# EasyEDA Pro project ProProject_CN3791_2024-04-01.epro

# Schematic Schematic1
Create Date: 2023-11-17; Page Name: P1; Project Name: CN3791; Schematic Name: Schematic1; Update Date: 2023-11-26; Company: EasyEDA.com; Drawed: EasyEDA Pro; Page Size: A4; Part Number: JLCPCB-002; Reviewed: EasyEDA Pro; Version: V0.1
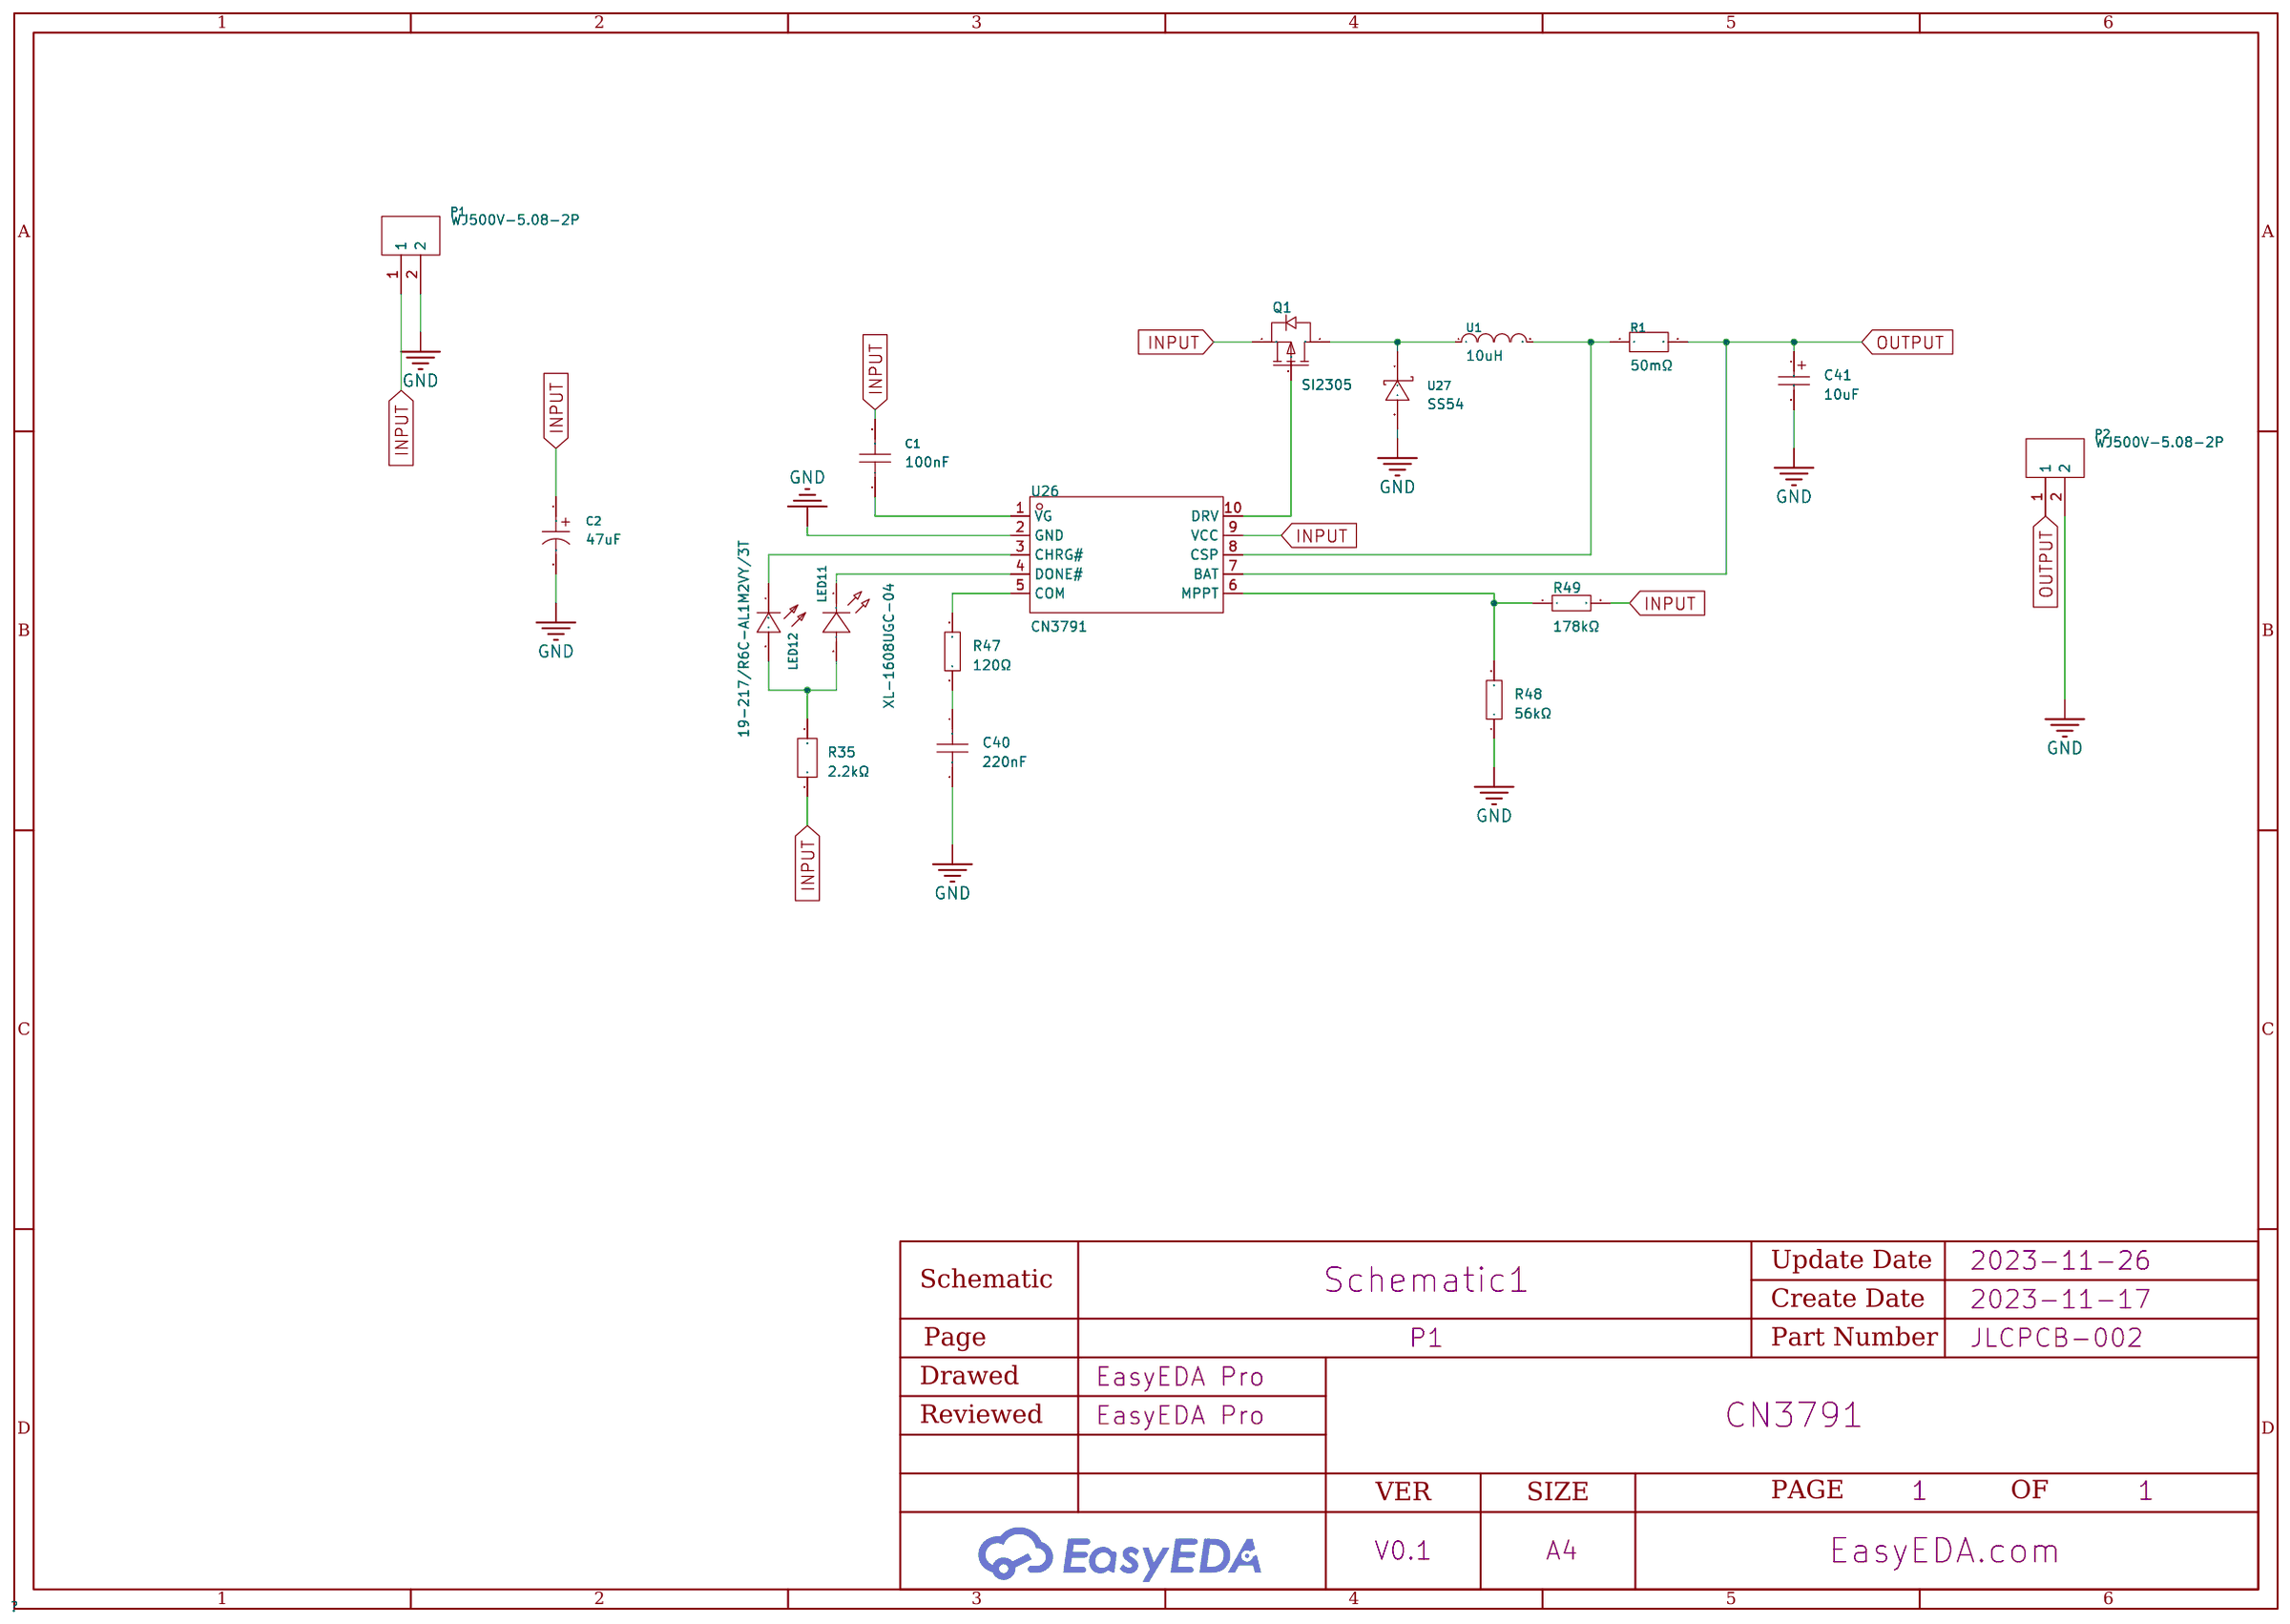
[diagram p0: schematic sheet]

## Parts
C1  100nF  [C0402]
C2  47uF  [CAP-SMD_BD6.3-L6.6-W6.6-LS7.6-FD]
C40  220nF  [C0402]
C41  10uF  [CAP-SMD_L3.2-W1.6-RD]
LED11  XL-1608UGC-04  [LED0603-RD_GREEN]
LED12  19-217/R6C-AL1M2VY/3T  [LED0603-RD]
P1  WJ500V-5.08-2P  [CONN-TH_2P-P5.00_WJ500V-5.08-2P]
P2  WJ500V-5.08-2P  [CONN-TH_2P-P5.00_WJ500V-5.08-2P]
Q1  SI2305  [SOT-23-3_L2.9-W1.3-P1.90-LS2.4-BR]
R1  50mΩ  [R1206]
R35  2.2kΩ  [R2010]
R47  120Ω  [R0402]
R48  56kΩ  [R0402]
R49  178kΩ  [R0402]
U1  10uH  [IND-SMD_L7.2-W6.6_GPSR07X0]
U26  CN3791  [SSOP-10_L4.9-W3.9-P1.00-LS6.0-BL]
U27  SS54  [SMC_L6.9-W5.9-LS7.9-RD]

## Library data of the parts
C1 = CT41G-0402-2X1-16V-0.1μF-K(N): Capacitance: Tolerance:±10% Tolerance:±10% Voltage Rated: Temperature Coefficient:; LCSC Part Name: 100nF ±10% 16V; Supplier Part: C141382; Manufacturer: TORCH(火炬); Supplier Footprint: 0402; JLCPCB Part Class: Extended Part; Datasheet: https://atta.szlcsc.com/upload/public/pdf/source/20171225/C150708_15141883600121203188.pdf; Supplier: LCSC; Tolerance: ±10%
C2 = RVT47UF50V67RV0029: Capacitance: Tolerance:±20% Tolerance:±20% Rated Voltage: Ripple Current:66mA@120Hz Equivalent Series Resistance(ESR):- φD: L: Lifetime @ Temp:2000hrs@105℃ Operating Temperature:-55℃~+105℃ Operating Temperature:-55℃~+105℃; LCSC Part Name: 47uF ±20% 50V; Supplier Part: C2887275; Manufacturer: KNSCHA(科尼盛); Supplier Footprint: SMD,D6.3xL7.7mm; JLCPCB Part Class: Extended Part; Datasheet: https://atta.szlcsc.com/upload/public/pdf/source/20210824/3B61B08E802BEB202F31F6CC5BD6B8B5.pdf; Supplier: LCSC; Tolerance: ±20%; Ripple Current: 66mA@120Hz; Lifetime @ Temp: 2000hrs@105℃; Operating Temperature: -55℃~+105℃
C40 = 0402B224K160NT: Capacitance: Tolerance:±10% Tolerance:±10% Voltage Rated: Temperature Coefficient:; LCSC Part Name: 220nF ±10% 16V; Supplier Part: C192432; Manufacturer: FH(风华); Supplier Footprint: 0402; JLCPCB Part Class: Extended Part; Supplier: LCSC; Tolerance: ±10%
C41 = CA45-A-16V-10uF-K: Capacitance: Tolerance:±10% Tolerance:±10% Rated Voltage: Equivalent Series Resistance(ESR):10Ω@100kHz Operating Temperature:-55℃~+125℃ Operating Temperature:-55℃~+125℃; LCSC Part Name: 10uF ±10% 16V; Supplier Part: C128254; Manufacturer: CEC(振华新云); Supplier Footprint: CASE-A-3216; JLCPCB Part Class: Extended Part; Datasheet: https://atta.szlcsc.com/upload/public/pdf/source/20170914/C128254_1505359752472967905.pdf; Supplier: LCSC; Tolerance: ±10%; Equivalent Series Resistance(ESR): 10Ω@100kHz; Operating Temperature: -55℃~+125℃
LED11 = XL-1608UGC-04: Emitted Color:Emerald Lens Color:Colorless transparence Dominant Wavelength:516nm~525nm Dominant Wavelength:516nm~525nm Peak Wavelength:534nm Color Temperature:- Color Temperature:- Forward Current:25mA Power Dissipation:80mW Viewing Angle:120° Mounting S; LCSC Part Name: 翠绿 正贴; Supplier Part: C965804; Manufacturer: XINGLIGHT(成兴光); Supplier Footprint: 0603; JLCPCB Part Class: Extended Part; Datasheet: https://atta.szlcsc.com/upload/public/pdf/source/20221102/520D6E465E5CFD1609C8A4DBC80D4018.pdf; Supplier: LCSC; Emitted Color: Emerald; Lens Color: Colorless transparence; Dominant Wavelength: 516nm~525nm; Peak Wavelength: 534nm; Forward Current: 25mA; Power Dissipation: 80mW; Viewing Angle: 120°; Mounting Sytle: Positive post; Operating Temperature: -30℃~+85℃
LED12 = 19-217/R6C-AL1M2VY/3T: Emitted Color:红灯 Diode Configuration:- Lens Color:Colorless transparence Dominant Wavelength:617.5nm~633.5nm Dominant Wavelength:617.5nm~633.5nm Peak Wavelength:632nm Color Temperature:- Color Temperature:- Forward Current:5mA Power Dissipation:60mW Viewi; LCSC Part Name: 红灯; Supplier Part: C72044; Manufacturer: EVERLIGHT(亿光); Supplier Footprint: 0603; JLCPCB Part Class: Extended Part; Datasheet: https://atta.szlcsc.com/upload/public/pdf/source/20160507/1462613613821.pdf; Supplier: LCSC; Emitted Color: 红灯; Lens Color: Colorless transparence; Dominant Wavelength: 617.5nm~633.5nm; Peak Wavelength: 632nm; Forward Current: 5mA; Power Dissipation: 60mW; Viewing Angle: 120°; Operating Temperature: -40℃~+85℃
P1 P2 = WJ500V-5.08-2P: Structure:1x2P Pitch:5.08mm Color:Green Mounting Style:Straight Current Rating (Max):18A Voltage Rating (Max):250V Number of Pins:2P Number of Rows:1 Wire Gauge - AWG:14~30 Wire Gauge - AWG:14~30 Wire Gauge - mm2:2.5 Wire Gauge - mm2:2.5 Number of PINs Pe; LCSC Part Name: 5.08mm 1x2P 排数:1 每排P数:2 直插; Supplier Part: C8465; Manufacturer: KANGNEX(康奈克斯电气); Supplier Footprint: 插件,P=5.08mm; JLCPCB Part Class: Extended Part; Datasheet: https://atta.szlcsc.com/upload/public/pdf/source/20191225/C8465_02D34CE5B5B4A53DF5891601D97FA9F4.pdf; Supplier: LCSC; Structure: 1x2P; Pitch: 5.08mm; Color: Green; Mounting Style: Straight; Current Rating (Max): 18A; Voltage Rating (Max): 250V; Number of Pins: 2P; Number of Rows: 1; Wire Gauge - AWG: 14~30; Wire Gauge - mm2: 2.5; Number of PINs Per Row: 2; Operating Temperature Range: -40℃~+105℃
Q1 = SI2305_C2909911: Type: Drain Source Voltage (Vdss): Continuous Drain Current (Id): Power Dissipation (Pd):1200mW Drain Source On Resistance (RDS(on)@Vgs,Id):55mΩ@4.5V,3.9A Gate Threshold Voltage (Vgs(th)@Id):1.5V@250uA Operating Temperature:+150℃@(Tj) Operating Temperatur; LCSC Part Name: P沟道 20V 3.9A; Supplier Part: C2909911; Manufacturer: YONGYUTAI(永裕泰); Supplier Footprint: SOT-23; JLCPCB Part Class: Extended Part; Datasheet: https://atta.szlcsc.com/upload/public/pdf/source/20211028/4F2ACEB29FC50726A1C5EE48299F6C38.pdf; Supplier: LCSC; Power Dissipation (Pd): 1200mW; Drain Source On Resistance (RDS(on)@Vgs,Id): 55mΩ@4.5V,3.9A; Gate Threshold Voltage (Vgs(th)@Id): 1.5V@250uA; Operating Temperature: +150℃@(Tj)
R1 = FRL1206JR050TS: Type:Thick Film Resistors Resistance:50mΩ Tolerance:±5% Tolerance:±5% Power(Watts):250mW Temperature Coefficient:±1200ppm/℃ Temperature Coefficient:±1200ppm/℃ Overload Voltage (Max):- Operating Temperature Range:-55℃~+155℃ Operating Temperature Range:-55℃; LCSC Part Name: 厚膜电阻 50mΩ ±5% 250mW; Supplier Part: C2974116; Manufacturer: FOJAN(富捷); Supplier Footprint: 1206; JLCPCB Part Class: Extended Part; Datasheet: https://atta.szlcsc.com/upload/public/pdf/source/20211221/925EC7D7225764EE0046F22065062C87.pdf; Supplier: LCSC; Type: Thick Film Resistors; Tolerance: ±5%; Power(Watts): 250mW; Temperature Coefficient: ±1200ppm/℃; Operating Temperature Range: -55℃~+155℃
R35 = 201007J0222T4E: Type:Thick Film Resistors Resistance: Tolerance:±5% Tolerance:±5% Power(Watts): Temperature Coefficient:±100ppm/℃ Temperature Coefficient:±100ppm/℃ Overload Voltage (Max): Operating Temperature Range:-55℃~+155℃ Operating Temperature Range:-55℃~+155℃; LCSC Part Name: 2.2kΩ ±5% 750mW; Supplier Part: C621177; Manufacturer: UNI-ROYAL(厚声); Supplier Footprint: 2010; JLCPCB Part Class: Extended Part; Datasheet: https://atta.szlcsc.com/upload/public/pdf/source/20200306/C422600_1E6D84923E4A46A82E41ADD87F860B5C.pdf; Supplier: LCSC; Type: Thick Film Resistors; Tolerance: ±5%; Temperature Coefficient: ±100ppm/℃; Operating Temperature Range: -55℃~+155℃
R47 = RC0402FR-07120RL: Type:Thick Film Resistors Resistance: Tolerance:±1% Tolerance:±1% Power(Watts): Temperature Coefficient:±100ppm/℃ Temperature Coefficient:±100ppm/℃ Overload Voltage (Max): Operating Temperature Range:-55℃~+155℃ Operating Temperature Range:-55℃~+155℃; LCSC Part Name: 120Ω ±1% 62.5mW; Supplier Part: C114758; Manufacturer: YAGEO(国巨); Supplier Footprint: 0402; JLCPCB Part Class: Extended Part; Datasheet: https://atta.szlcsc.com/upload/public/pdf/source/20170912/C114758_1505207815629963476.pdf; Supplier: LCSC; Type: Thick Film Resistors; Tolerance: ±1%; Temperature Coefficient: ±100ppm/℃; Operating Temperature Range: -55℃~+155℃
R48 = RC0402FR-0756KL: Type:Thick Film Resistors Resistance: Tolerance:±1% Tolerance:±1% Power(Watts): Temperature Coefficient:±100ppm/℃ Temperature Coefficient:±100ppm/℃ Overload Voltage (Max): Operating Temperature Range:-55℃~+155℃ Operating Temperature Range:-55℃~+155℃; LCSC Part Name: 56kΩ ±1% 62.5mW; Supplier Part: C114756; Manufacturer: YAGEO(国巨); Supplier Footprint: 0402; JLCPCB Part Class: Extended Part; Datasheet: https://atta.szlcsc.com/upload/public/pdf/source/20170912/C114756_1505207814158963474.pdf; Supplier: LCSC; Type: Thick Film Resistors; Tolerance: ±1%; Temperature Coefficient: ±100ppm/℃; Operating Temperature Range: -55℃~+155℃
R49 = RM04FTN1783: Type:Thick Film Resistors Resistance: Tolerance:±1% Tolerance:±1% Power(Watts): Temperature Coefficient:±100ppm/℃ Temperature Coefficient:±100ppm/℃ Overload Voltage (Max): Operating Temperature Range:-55℃~+155℃ Operating Temperature Range:-55℃~+155℃; LCSC Part Name: 178kΩ ±1% 62.5mW; Supplier Part: C162927; Manufacturer: 大毅科技; Supplier Footprint: 0402; JLCPCB Part Class: Extended Part; Datasheet: https://atta.szlcsc.com/upload/public/pdf/source/20180111/C162927_15156543014331258784.pdf; Supplier: LCSC; Type: Thick Film Resistors; Tolerance: ±1%; Temperature Coefficient: ±100ppm/℃; Operating Temperature Range: -55℃~+155℃
U1 = CYA0630-10UH: Inductance: Tolerance:±20% Tolerance:±20% Rated Current: DC Resistance (DCR):; LCSC Part Name: 10uH ±20%; Supplier Part: C5189958; Manufacturer: SHOU HAN(首韩); Supplier Footprint: SMD,6.6x7.2mm; JLCPCB Part Class: Extended Part; Datasheet: https://atta.szlcsc.com/upload/public/pdf/source/20221010/B55E8796F05F85A38044F3826C14EFDD.pdf; Supplier: LCSC; Tolerance: ±20%
U26 = CN3791: Supplier Part: C154992; Manufacturer: CONSONANCE(上海如韵); Supplier Footprint: SSOP-10; JLCPCB Part Class: Extended Part; Datasheet: https://atta.szlcsc.com/upload/public/pdf/source/20180228/C154992_15198053154561377167.pdf; Supplier: LCSC
U27 = SS54_C5307984: Supplier Part: C5307984; Manufacturer: 晶扬电子; Supplier Footprint: SMA; JLCPCB Part Class: Extended Part; Supplier: LCSC

## Nets
GND: C2.2 C40.2 C41.2 P1.2 P2.2 R48.1 U26.2(GND) U27.2(A)
INPUT: C1.2 C2.1 P1.1 Q1.2(S) R35.2 R49.2 U26.9(VCC)
OUTPUT: C41.1 P2.1 R1.2 U26.7(BAT)
$1N745: C40.1 R47.1
$1N751: R47.2 U26.5(COM)
$1N753: Q1.3(D) U1.1 U27.1(K)
$1N867: C1.1 U26.1(VG)
$1N1034: R48.2 R49.1 U26.6(MPPT)
$1N1115: R1.1 U1.2 U26.8(CSP)
$1N1346: Q1.1(G) U26.10(DRV)
Net-(LED11-1): LED11.1(K) U26.4(DONE#)
Net-(LED11-2): LED11.2(A) LED12.2(A) R35.1
Net-(LED12-1): LED12.1(C) U26.3(CHRG#)

# Board PCB1
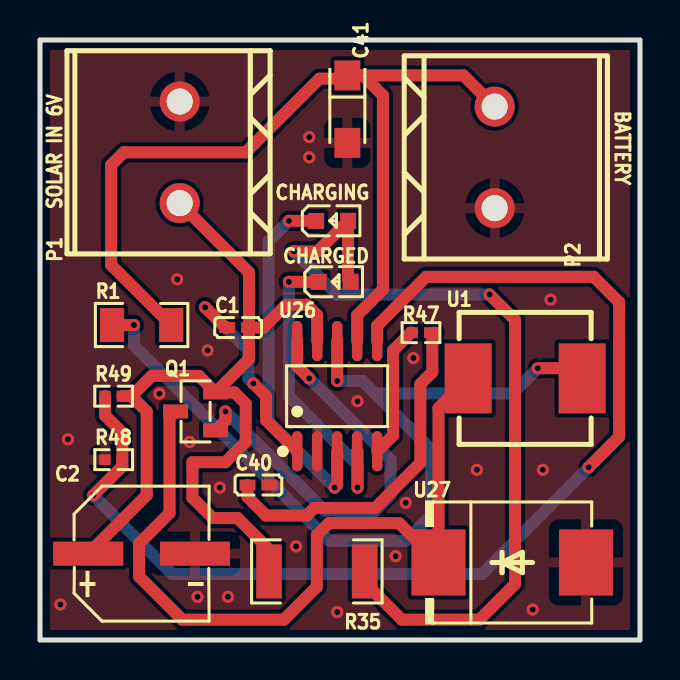
[diagram p1: board, top side]
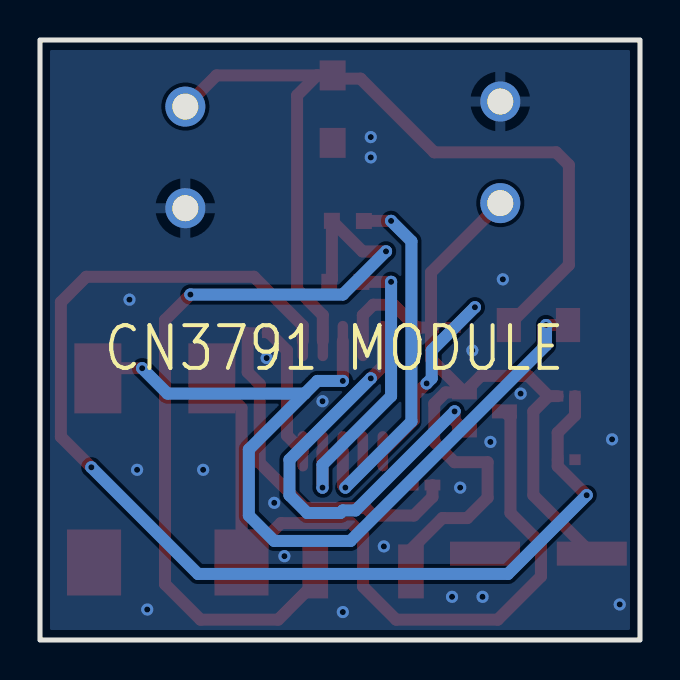
[diagram p2: board, bottom side, seen from below]

Outline 30 x 30 mm; copper layers: Top Layer, Bottom Layer. Coordinates in mm from the lower left corner of the outline.
Outline path: rectangle 0,30 30,0
Stack: Top Layer 0.035mm / Dielectric1 1.51mm FR4 er 4.5 / Bottom Layer 0.035mm

## Design rules (mm)
template: JLCPCB Capability(Two Layers Board)
spacing copperThickness1oz (default): track to track 0.102, other pairs 0.152 to 0.3
spacing copperThickness2oz: track to track 0.203, other pairs 0.152 to 0.3
track width copperThickness1oz (default): min 0.127, default 0.254, max 2.54
track width copperThickness2oz: min 0.203, default 0.254, max 2.54
differential pair differentialPair (default): width min 0.127, default 0.254, max 2.54; gap min 0.152, default 0.152
via viaSize (default): diameter min 0.5, default 0.61, max 10; hole min 0.3, default 0.305, max 6.3

## Placement (name value [footprint] x y rotation side)
C1  100nF  [C0402]  9.91 15.62 0 top
C2  47uF  [CAP-SMD_BD6.3-L6.6-W6.6-LS7.6-FD]  5.08 4.32 0 top
C40  220nF  [C0402]  10.92 7.75 0 top
C41  10uF  [CAP-SMD_L3.2-W1.6-RD]  15.37 26.54 270 top
CHARGED  XL-1608UGC-04  [LED0603-RD_GREEN]  14.73 17.91 0 top
CHARGING  19-217/R6C-AL1M2VY/3T  [LED0603-RD]  14.6 20.95 0 top
P1  WJ500V-5.08-2P  [CONN-TH_2P-P5.00_WJ500V-5.08-2P]  6.98 24.38 90 top
P2  WJ500V-5.08-2P  [CONN-TH_2P-P5.00_WJ500V-5.08-2P]  22.73 24.13 270 top
Q1  SI2305  [SOT-23-3_L2.9-W1.3-P1.90-LS2.4-BR]  7.78 11.43 0 top
R1  50mΩ  [R1206]  5.08 15.75 0 top
R35  2.2kΩ  [R2010]  13.84 3.43 180 top
R47  120Ω  [R0402]  19.05 15.37 180 top
R48  56kΩ  [R0402]  3.68 9.02 0 top
R49  178kΩ  [R0402]  3.68 12.19 0 top
U1  10uH  [IND-SMD_L7.2-W6.6_GPSR07X0]  24.26 13.08 0 top
U26  CN3791  [SSOP-10_L4.9-W3.9-P1.00-LS6.0-BL]  14.86 12.19 0 top
U27  SS54  [SMC_L6.9-W5.9-LS7.9-RD]  23.61 3.88 0 top

## Footprints (pads in the part's own frame, mm; a bottom-side part is the same pattern mirrored in y, then rotated)
C0402
  rect 0.79x0.54 smd: 1(-0.545,0) 2(0.545,0)
CAP-SMD_BD6.3-L6.6-W6.6-LS7.6-FD
  rect 3.5x1.2 smd: 1(-2.67,0) 2(2.67,0)
CAP-SMD_L3.2-W1.6-RD
  rect 1.5x1.296 smd: 1(-1.687,0) 2(1.687,0)
CONN-TH_2P-P5.00_WJ500V-5.08-2P
  round 2 hole 1.3: 1(-2.54,0) 2(2.54,0)
IND-SMD_L7.2-W6.6_GPSR07X0
  rect 2.35x3.5 smd: 1(-2.85,0) 2(2.85,0)
LED0603-RD
  rect 0.8x0.8 smd: 1(-0.799,-0.004) 2(0.799,0.004)
LED0603-RD_GREEN
  rect 0.8x0.8 smd: 1(-0.799,-0.004) 2(0.799,0.004)
R0402
  rect 0.566x0.54 smd: 1(-0.433,0) 2(0.433,0)
R1206
  rect 1.208x1.701 smd: 1(-1.479,0) 2(1.479,0)
R2010
  rect 1.282x2.7 smd: 1(-2.391,0) 2(2.391,0)
SMC_L6.9-W5.9-LS7.9-RD
  rect 2.7x3.3 smd: 1(-3.687,0) 2(3.687,0)
SOT-23-3_L2.9-W1.3-P1.90-LS2.4-BR
  rect 1.25x0.7 smd: 1(1,-0.95) 2(1,0.95) 3(-1,0)
SSOP-10_L4.9-W3.9-P1.00-LS6.0-BL
  oval 0.525x2.014 smd: 1(-2,-2.756) 2(-1,-2.756) 3(0,-2.756) 4(1,-2.756) 5(2,-2.756) 6(2,2.756) 7(1,2.756) 8(0,2.756) 9(-1,2.756) 10(-2,2.756)

## Nets
GND: C2.2 C40.2 C41.2 P1.2 P2.2 R48.1 U26.2 U27.2
INPUT: C1.2 C2.1 P1.1 Q1.2 R35.2 R49.2 U26.9
OUTPUT: C41.1 P2.1 R1.2 U26.7
$1N447: CHARGED.1 U26.4
$1N450: CHARGING.1 U26.3
$1N458: CHARGED.2 CHARGING.2 R35.1
$1N745: C40.1 R47.1
$1N751: R47.2 U26.5
$1N753: Q1.3 U1.1 U27.1
$1N867: C1.1 U26.1
$1N1034: R48.2 R49.1 U26.6
$1N1115: R1.1 U1.2 U26.8
$1N1346: Q1.1 U26.10

## Via types
v1: diameter 0.61, hole 0.305, Top Layer to Bottom Layer, 36 vias

## Routing (per net, layer and track width the routed paths; a pad name or vN(x,y) marks a point on that pad's centre or on a via; arc(x,y) is an arc through that point)
GND:
  vias: v1(1.02,1.78) v1(1.4,10.03) v1(5.97,12.32) v1(6.86,18.03) v1(7.48,9.9) v1(7.87,2.16) v1(8.38,14.48) v1(8.99,7.62) v1(9.4,2.16) v1(12.81,4.68) v1(13.46,25.15) v1(13.46,24.13) v1(14.86,1.4) v1(15.88,11.94) v1(17.78,4.19) v1(18.29,6.86) v1(18.67,14.1) v1(21.84,8.51) v1(24.64,1.52) v1(25.15,8.51) v1(25.53,17.02)
INPUT: length 45.2
  Top Layer w0.6: U26.9 13.86,16.24 13.33,16.76 12.32,16.76 11.18,15.62 C1.2 ; 4.57,12.19 5.59,13.21 7.95,13.21 Q1.2 ; 4.57,12.19 5.33,11.43 5.33,7.24 C2.1 ; 4.57,12.19 R49.2 ; 11.43,4.55 9.88,6.1 8.64,6.1 7.62,7.11 7.62,8.89 9.27,8.89 10.29,9.91 10.29,11.81 9.72,12.38 Q1.2 ; Q1.2 10.45,14.05 C1.2 ; C1.2 10.45,18.38 P1.1
OUTPUT: length 45.2
  Top Layer w0.6: 16.15,28.23 17.14,27.23 17.14,17.53 15.86,16.24 U26.7 ; 16.15,28.23 C41.1 15.2,28.07 13.97,28.07 10.29,24.38 4.19,24.38 3.56,23.75 3.56,18.75 R1.2 ; 16.15,28.23 21.17,28.23 P2.1
$1N447: length 15
  Top Layer w0.6: CHARGED.1 13.93,17.91 v1(12.45,17.91) ; U26.4 15.88,9.42 v1(15.88,7.62)
  Bottom Layer w0.6: v1(12.45,17.91) 12.45,12.19 15.88,8.76 v1(15.88,7.62)
$1N450: length 18.4
  Top Layer w0.6: v1(12.45,20.95) 13.8,20.95 CHARGING.1 ; v1(14.73,7.62) 14.86,7.75 U26.3
  Bottom Layer w0.6: v1(14.73,7.62) 11.43,10.92 11.43,19.94 v1(12.45,20.95)
$1N458: length 42.3
  Top Layer w0.6: v1(22.48,17.27) 23.75,16 23.75,2.79 21.97,1.02 18.09,1.02 16.21,2.9 16.21,4.04 ; v1(12.7,19.43) 13.88,19.43 CHARGING.2 15.4,18.04 CHARGED.2
  Bottom Layer w0.6: v1(12.7,19.43) 14.86,17.27 v1(22.48,17.27)
$1N745: length 17.5
  Top Layer w0.6: C40.1 10.38,7.15 11.3,6.22 13.33,6.22 13.72,6.6 16.76,6.6 19.01,8.85 19.01,12.79 19.61,13.39 19.61,15.24 19.74,15.37
$1N751: length 6.7
  Top Layer w0.6: U26.5 17.65,10.23 17.65,14.48 18.54,15.37 R47.2
$1N753: length 39
  Top Layer w0.6: U1.1 19.92,11.6 U27.1 17.96,5.84 14.44,5.84 13.84,5.24 13.84,2.67 12.19,1.02 7.11,1.02 4.95,3.17 4.95,4.83 6.48,6.35 6.48,11.13 Q1.3
$1N867: length 10.6
  Top Layer w0.6: U26.1 11.3,10.99 11.3,12.19 v1(10.67,12.83) ; v1(8.25,16.64) 9.27,15.62 C1.1
  Bottom Layer w0.6: v1(10.67,12.83) 10.41,13.08 10.41,14.48 v1(8.25,16.64)
$1N1034: length 57.8
  Top Layer w0.6: U26.6 16.86,15.72 19.3,18.16 27.69,18.16 28.96,16.89 28.96,10.16 v1(27.43,8.64) ; v1(2.67,7.24) 4.12,8.69 R48.2 4.12,10.36 3.25,11.23 R49.1
  Bottom Layer w0.6: v1(2.67,7.24) 6.6,3.3 22.1,3.3 v1(27.43,8.64)
$1N1115: length 44
  Top Layer w0.6: v1(14.86,12.95) U26.8 ; v1(24.89,13.59) 26.6,13.59 U1.2 ; v1(4.7,15.75) R1.1
  Bottom Layer w0.6: v1(24.89,13.59) 23.62,12.32 16.76,12.32 ; v1(4.7,15.75) 4.7,14.73 14.48,4.95 18.29,4.95 19.56,6.22 19.56,9.52 16.76,12.32 ; 16.76,12.32 16.13,12.95 v1(14.86,12.95)
$1N1346: length 21.5
  Top Layer w0.6: v1(13.46,13.08) 12.86,13.68 U26.10 ; v1(9.27,11.43) 9.27,10.97 Q1.1
  Bottom Layer w0.6: v1(9.27,11.43) 14.22,6.48 14.86,6.48 14.99,6.35 16.64,6.35 17.53,7.24 17.53,9.02 v1(13.46,13.08)

## Copper pours and planes (outline as drawn; the poured copper is in the pictures)
GND on Top Layer: -0.89,30.86 30.48,30.86 30.48,-1.14 -0.89,-1.14
GND on Bottom Layer: -3.43,31.24 31.62,31.24 31.62,-2.16 -3.43,-2.16

## Text on the board
Bottom Silkscreen Layer: CN3791 MODULE
Top Silkscreen Layer: SOLAR IN 6V | BATTERY
